# Altium schematic sheet SDEC944-xD_D‚tecteurs_pr‚sence_(alim+signal+ouverture).SchDoc: Détecteurs présence (alim+signal+ouverture capot)
size 393 x 270 mm; CompanyName: Seccom; Address1: 521, rue du capt. François Garbit; Address2: 69440 Mornant; Address3: seccom@seccom.fr; Address4: www.seccom.fr; DocumentNumber: 11; SheetNumber: 11; SheetTotal: 22; PageSetup: Record=PageOptions|CenterHorizontal=True|CenterVertical=True|PrintScale=0.74|XCorrection=1.00|YCorrection=1.00|PrintKind=0|BorderSize=5000000|LeftOffset=0|BottomOffset=0|Orientation=2|PaperLength=1000|PaperWidth=1000|Scale=100|PaperSource=7|PrintQuality=-4|MediaType=1|DitherType=10|PaperKind=A4|PrintScaleMode=1
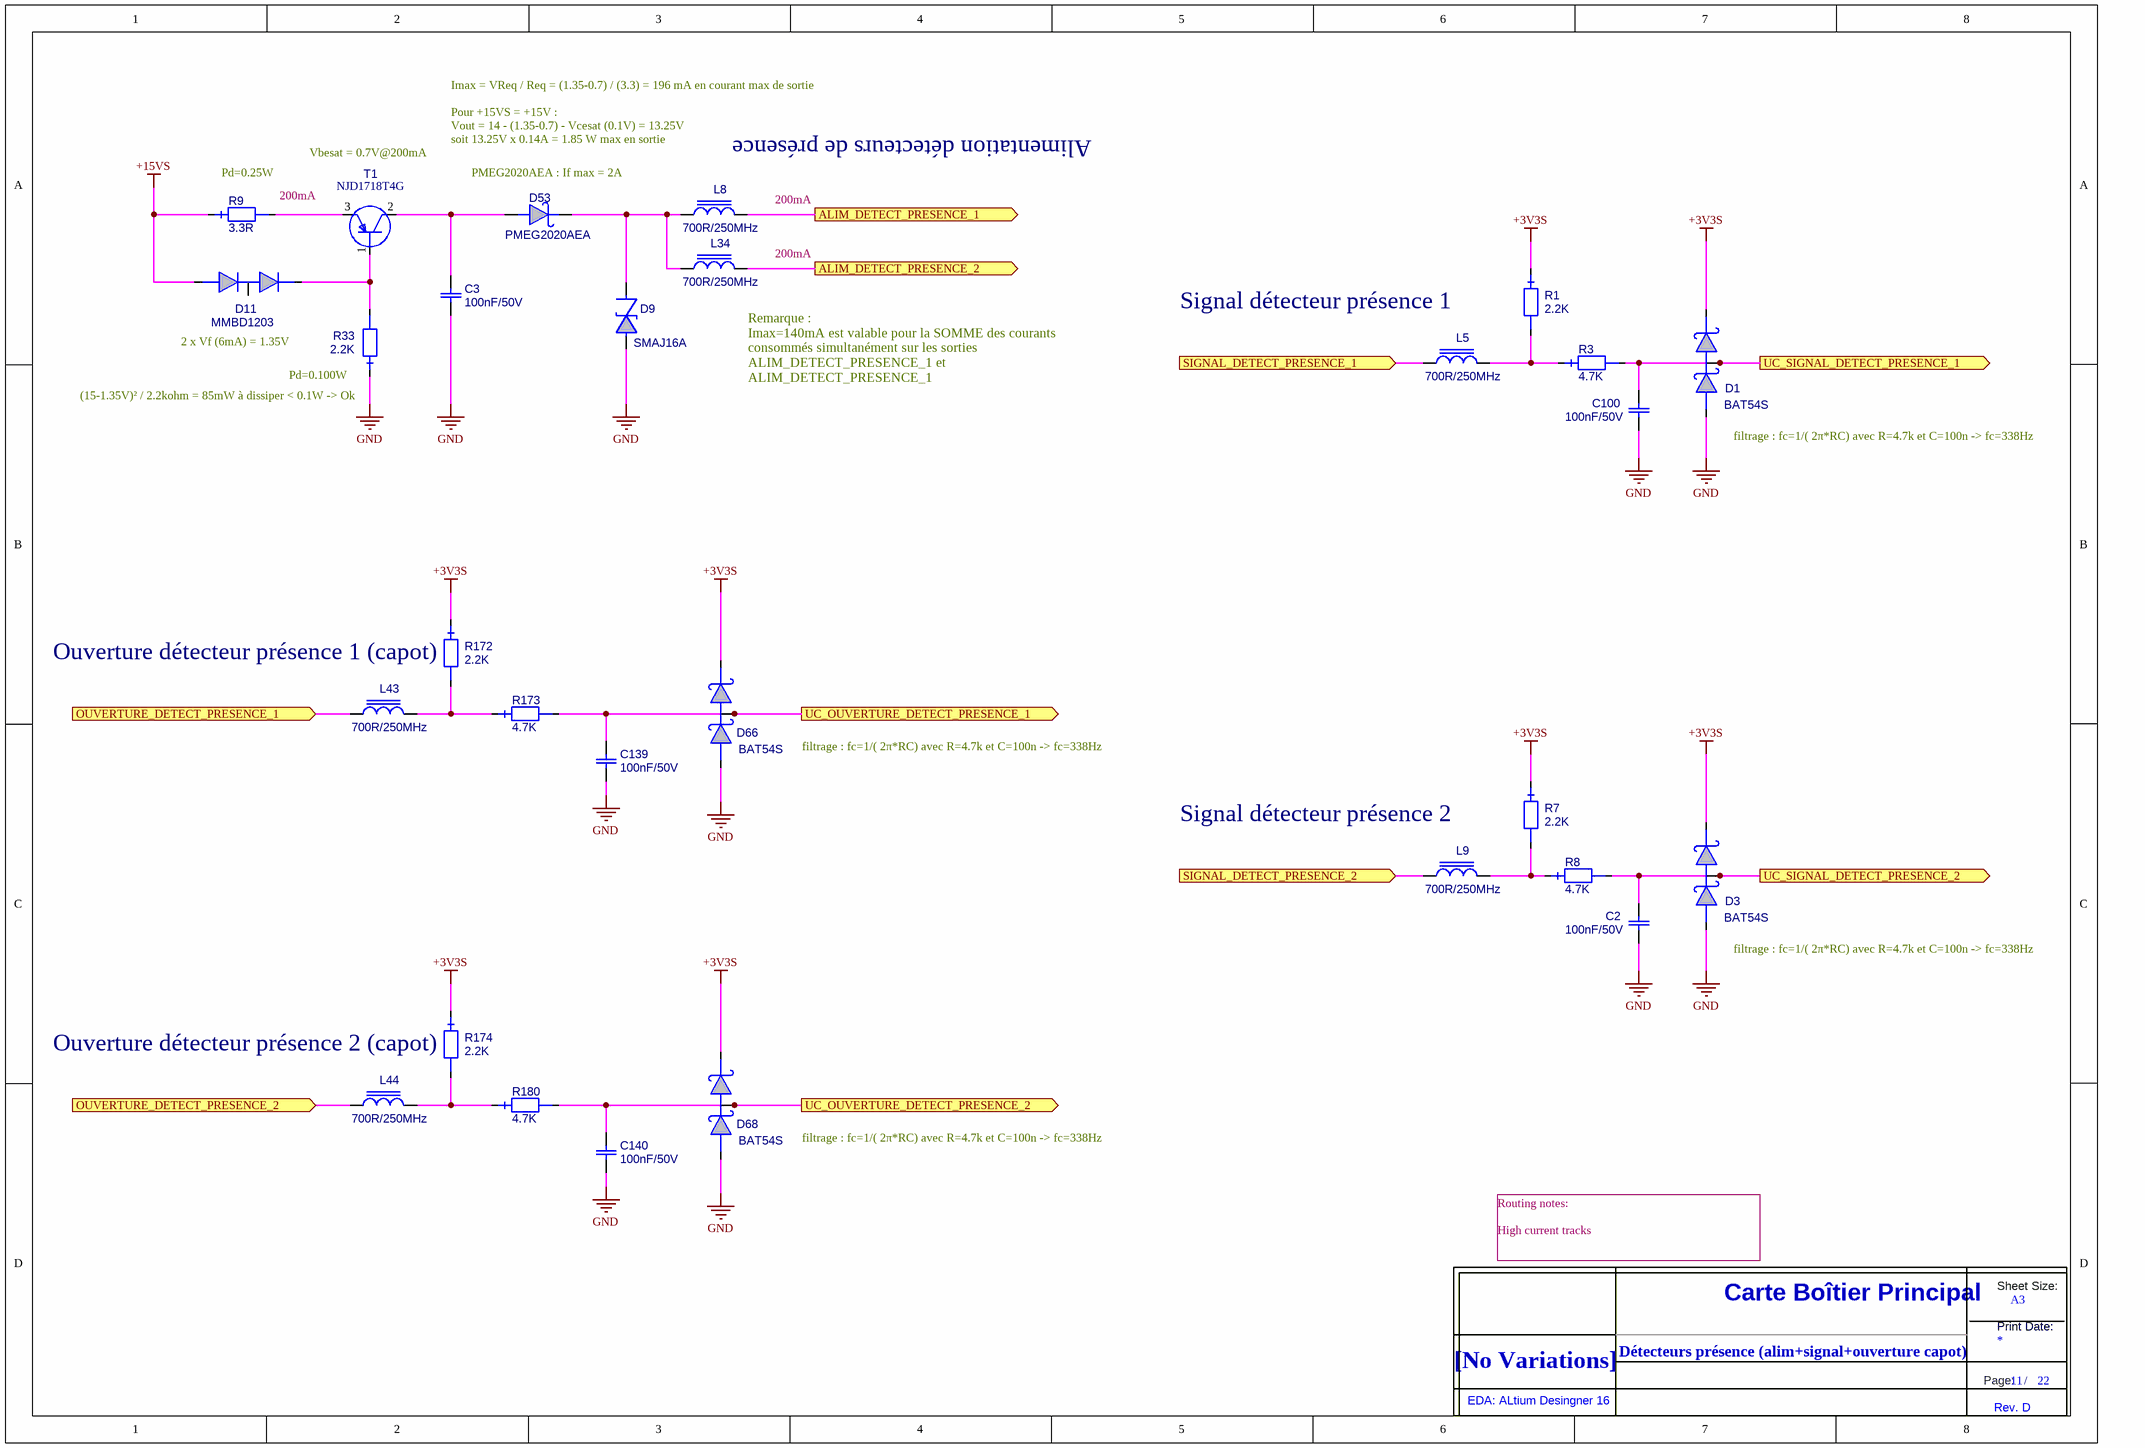
[diagram p0: SDEC944-xD_D‚tecteurs_pr‚sence_(alim+signal+ouverture).SchDoc]

## Parts
C2  value 100nF/50V  [0603_ReflowSoldering_CAP]  (hidden comment: C_0603_X7R_10%_100N-50V)
C3  value 100nF/50V  [0603_ReflowSoldering_CAP]  (hidden comment: C_0603_X7R_10%_100N-50V)
C100  value 100nF/50V  [0603_ReflowSoldering_CAP]  (hidden comment: C_0603_X7R_10%_100N-50V)
C139  value 100nF/50V  [0603_ReflowSoldering_CAP]  (hidden comment: C_0603_X7R_10%_100N-50V)
C140  value 100nF/50V  [0603_ReflowSoldering_CAP]  (hidden comment: C_0603_X7R_10%_100N-50V)
D1  BAT54S  [SOT23_3L_ReflowSoldering]
D3  BAT54S  [SOT23_3L_ReflowSoldering]
D9  SMAJ16A  [DO214AC-SMA-P_ReflowSoldering]
D11  MMBD1203  [SOT23_3L_ReflowSoldering]
D53  PMEG2020AEA  [SOD323_ReflowSoldering]
D66  BAT54S  [SOT23_3L_ReflowSoldering]
D68  BAT54S  [SOT23_3L_ReflowSoldering]
L5  value 700R/250MHz  [0603_ReflowSoldering_CAP]  (hidden comment: IND_FERRITE_0603_742792643)
L8  value 700R/250MHz  [0603_ReflowSoldering_CAP]  (hidden comment: IND_FERRITE_0603_742792643)
L9  value 700R/250MHz  [0603_ReflowSoldering_CAP]  (hidden comment: IND_FERRITE_0603_742792643)
L34  value 700R/250MHz  [0603_ReflowSoldering_CAP]  (hidden comment: IND_FERRITE_0603_742792643)
L43  value 700R/250MHz  [0603_ReflowSoldering_CAP]  (hidden comment: IND_FERRITE_0603_742792643)
L44  value 700R/250MHz  [0603_ReflowSoldering_CAP]  (hidden comment: IND_FERRITE_0603_742792643)
R1  value 2.2K  [0603_ReflowSoldering_RES]  (hidden comment: RES_0603_1%_100PPM_2.2K)
R3  value 4.7K  [0603_ReflowSoldering_RES]  (hidden comment: RES_0603_1%_100PPM_4.7K)
R7  value 2.2K  [0603_ReflowSoldering_RES]  (hidden comment: RES_0603_1%_100PPM_2.2K)
R8  value 4.7K  [0603_ReflowSoldering_RES]  (hidden comment: RES_0603_1%_100PPM_4.7K)
R9  value 3.3R  [1206_ReflowSoldering_RES]  (hidden comment: RES_1206_1%_200PPM_3.3R)
R33  value 2.2K  [0603_ReflowSoldering_RES]  (hidden comment: RES_0603_1%_100PPM_2.2K)
R172  value 2.2K  [0603_ReflowSoldering_RES]  (hidden comment: RES_0603_1%_100PPM_2.2K)
R173  value 4.7K  [0603_ReflowSoldering_RES]  (hidden comment: RES_0603_1%_100PPM_4.7K)
R174  value 2.2K  [0603_ReflowSoldering_RES]  (hidden comment: RES_0603_1%_100PPM_2.2K)
R180  value 4.7K  [0603_ReflowSoldering_RES]  (hidden comment: RES_0603_1%_100PPM_4.7K)
T1  NJD1718T4G  [DPAK_Specifique_1]
Title_new  DNI  (value not drawn)  (graphical)

## Ports
ALIM_DETECT_PRESENCE_1 (out), ALIM_DETECT_PRESENCE_2 (out), OUVERTURE_DETECT_PRESENCE_1 (in), OUVERTURE_DETECT_PRESENCE_2 (in), SIGNAL_DETECT_PRESENCE_1 (in), SIGNAL_DETECT_PRESENCE_2 (in), UC_OUVERTURE_DETECT_PRESENCE_1 (out), UC_OUVERTURE_DETECT_PRESENCE_2 (out), UC_SIGNAL_DETECT_PRESENCE_1 (out), UC_SIGNAL_DETECT_PRESENCE_2 (out)

## Nets
+3V3S: D1.2 D3.2 D66.2 D68.2 R1.1 R7.1 R172.1 R174.1
+15VS: D11.1 R9.1
GND: C2.2 C3.2 C100.2 C139.2 C140.2 D1.1 D3.1 D9.A D66.1 D68.1 R33.1
ALIM_DETECT_PRESENCE_1: L8.2 ; port ALIM_DETECT_PRESENCE_1
ALIM_DETECT_PRESENCE_2: L34.2 ; port ALIM_DETECT_PRESENCE_2
OUVERTURE_DETECT_PRESENCE_1: L43.1 ; port OUVERTURE_DETECT_PRESENCE_1
OUVERTURE_DETECT_PRESENCE_2: L44.1 ; port OUVERTURE_DETECT_PRESENCE_2
SIGNAL_DETECT_PRESENCE_1: L5.1 ; port SIGNAL_DETECT_PRESENCE_1
SIGNAL_DETECT_PRESENCE_2: L9.1 ; port SIGNAL_DETECT_PRESENCE_2
UC_OUVERTURE_DETECT_PRESENCE_1: C139.1 D66.3 R173.2 ; port UC_OUVERTURE_DETECT_PRESENCE_1
UC_OUVERTURE_DETECT_PRESENCE_2: C140.1 D68.3 R180.2 ; port UC_OUVERTURE_DETECT_PRESENCE_2
UC_SIGNAL_DETECT_PRESENCE_1: C100.1 D1.3 R3.2 ; port UC_SIGNAL_DETECT_PRESENCE_1
UC_SIGNAL_DETECT_PRESENCE_2: C2.1 D3.3 R8.2 ; port UC_SIGNAL_DETECT_PRESENCE_2
NetC3_1: C3.1 D53.A T1.2(C)
NetD9_K: D9.K D53.K L8.1 L34.1
NetD11_2: D11.2 R33.2 T1.1(B)
NetL5_2: L5.2 R1.2 R3.1
NetL9_2: L9.2 R7.2 R8.1
NetL43_2: L43.2 R172.2 R173.1
NetL44_2: L44.2 R174.2 R180.1
NetR9_2: R9.2 T1.3(E)

Not connected (* = marked no-connect by the designer): D11 3

## Notes on the sheet
- Imax = VReq / Req = (1.35-0.7) / (3.3) = 196 mA en courant max de sortie
- Pour +15VS = +15V :
- (near R9) Pd=0.25W
- Vbesat = 0.7V@200mA
- soit 13.25V x 0.14A = 1.85 W max en sortie
- Vout = 14 - (1.35-0.7) - Vcesat (0.1V) = 13.25V
- (near D53) PMEG2020AEA : If max = 2A
- Alimentation détecteurs de présence
- (near R9) 200mA
- (near L8) 200mA
- 200mA
- (near R1) Signal détecteur présence 1
- 2 x Vf (6mA) = 1.35V
- (near R33) Pd=0.100W
- (near R33) (15-1.35V)² / 2.2kohm = 85mW à dissiper < 0.1W -> Ok
- (near L34) Remarque :
  Imax=140mA est valable pour la SOMME des courants consommés simultanément sur les sorties ALIM_DETECT_PRESENCE_1 et ALIM_DETECT_PRESENCE_1
- (near D1) filtrage : fc=1/( 2π*RC) avec R=4.7k et C=100n -> fc=338Hz
- (near R172) Ouverture détecteur présence 1 (capot)
- filtrage : fc=1/( 2π*RC) avec R=4.7k et C=100n -> fc=338Hz
- (near R7) Signal détecteur présence 2
- (near D3) filtrage : fc=1/( 2π*RC) avec R=4.7k et C=100n -> fc=338Hz
- (near R174) Ouverture détecteur présence 2 (capot)
- Routing notes:
  High current tracks
- Détecteurs présence (alim+signal+ouverture capot)
- (in symbol Title_new) Sheet Size:; Carte Boîtier Principal; A3; Print Date:; [No Variations]; Page:; /; EDA: ALtium Desingner 16; Rev. D

## Library data of the parts
C2 C3 C100 C139 C140 = C_0603_X7R_10%_100N-50V: Condensateur céramique, X7R, 10%, CMS 0603, 100nF/50V; Creation: FB (29/02/12); Boitier: 0603; Remarque: {Remarque}; Fabricant: Kemet; Ref Fab: C0603C104K5RAC; Coeff: 1; ComponentLink1URL: O:\_Documentation\Datasheets\Kemet\Condos_Ceramic_CMS.pdf; ComponentLink2URL: o:\_Documentation\Datasheets\_BOITIERS\PASSIF_CMS\; Config: *; ComponentLink1Description: Datasheet; ComponentLink2Description: Datasheet Boitier; Supplier 1: Farnell; Supplier Part Number 1: 1288255
D1 D3 D66 D68 = BAT54S: Diode Schottky double, BAT54 en série, Vrrm=30V, If=200mA, Vf=0.4Vmax, CMS; Creation: JMP 05/09/2002; Verification: GO (26/09/02); Reference: 000206/00; Boitier: SOT23_3L; Remarque: {Remarque}; Coeff: 1; Fabricant: NXP; ComponentLink1URL: O:\_Documentation\Datasheets\NXP\BAT54_series.pdf; ComponentLink2URL: o:\_Documentation\Datasheets\_BOITIERS\ACTIF_CMS\SOT\SOT_23_3P_(Schneider).PDF; Config: *; ComponentLink1Description: Datasheet; ComponentLink2Description: Datasheet Boitier; Ref Fab: BAT54S; Supplier 1: Farnell; Supplier Part Number 1: 1081194; Value: BAT54S; Supplier 2: Mouser; Supplier Part Number 2: 771-BAT54S-T/R
D9 = SMAJ16A: Diode Transil/TVS unidirectionnelle (A), Transzorb, 400W, 16V, CMS; Creation: ZA (29/07/13); Boitier: DO214AC/SMA; Remarque: {Remarque}; Coeff: 1; Fabricant: Bourns; ComponentLink1URL: o:\_Documentation\Datasheets\Bourns\SMAJ-74970.pdf; ComponentLink2URL: o:\_Documentation\Datasheets\_BOITIERS\ACTIF_CMS\SMx\SMB_(Schneider).lnk; Config: *; ComponentLink1Description: Datasheet; ComponentLink2Description: Datasheet Boitier; Ref Fab: SMAJ16A; Supplier 1: Farnell; Supplier Part Number 1: 1843352; Supplier 2: Mouser; Supplier Part Number 2: 652-SMAJ16A; Value: SMAJ16A
D11 = MMBD1203: Diode de Redressement double, en série, Vrrm=100V, If=200mA, Vf=1V, rapide (trr=4ns), CMS; Creation: LJ (28/04/11); Reference: 001730/00; Boitier: SOT23_3L; Remarque: {Remarque}; Coeff: 1; Fabricant: Fairchild; ComponentLink1URL: o:\_Documentation\Datasheets\Fairchild\MMBD1201-2-3-4-5.pdf; ComponentLink2URL: o:\_Documentation\Datasheets\_BOITIERS\ACTIF_CMS\SOT\SOT_23_3P_(Schneider).PDF; Config: *; ComponentLink1Description: Datasheet; ComponentLink2Description: Datasheet Boitier; Supplier 1: Farnell; Supplier 2: Mouser; Supplier Part Number 1: 1700901; Supplier Part Number 2: 512-MMBD1203; Ref Fab: MMBD1203; Value: MMBD1203
D53 = PMEG2020AEA: Diode Schottky, Vrrm=20V, If=2A, Vf=0.45V, CMS; Creation: PDP (10/07/12); Boitier: SOD323; Remarque: {Remarque}; Coeff: 1; Fabricant: NXP; Verification: *; ComponentLink1URL: o:\_Documentation\Datasheets\NXP\PMEG2020AEA.PDF; ComponentLink2URL: o:\_Documentation\Datasheets\_BOITIERS\ACTIF_CMS\SOD\SOD_80_(MLL34)_(Schneider).PDF; Config: *; ComponentLink1Description: Datasheet; ComponentLink2Description: Datasheet Boitier; Ref Fab: PMEG2020AEA; Value: PMEG2020AEA
L5 L8 L9 L34 L43 L44 = IND_FERRITE_0603_742792643: Inductance à ferrite multicouches CMS, imp=700R@250MHz, +/-25%, Rdc=350mR, I=400mA; Creation: PDP (02/08/12); Boitier: 0603; Coeff: 1; Fabricant: Wurth Elektronik; ComponentLink1URL: o:\_Documentation\Datasheets\Murata\Ferrite_BLM21P.pdf; Config: *; ComponentLink1Description: Datasheet; ComponentLink2Description: Datasheet Boitier; Ref Fab: 742792643; Supplier 1: Farnell; Supplier Part Number 1: 1800349
R1 R7 R33 R172 R174 = RES_0603_1%_100PPM_2.2K: Résistance, 0.100W, 1%, 100ppm, 75V, 2.2K; Creation: JPL (05/07/12); Boitier: 0603; Remarque: {Remarque}; Fabricant: Vishay; Ref Fab: CRCW06032K20FKEA; Coeff: 1; Verification: *; ComponentLink1URL: O:\_Documentation\Datasheets\Vishay\Resistances_D-CRCWe3.pdf; ComponentLink2URL: o:\_Documentation\Datasheets\_BOITIERS\PASSIF_CMS\; Config: *; ComponentLink1Description: Datasheet; ComponentLink2Description: Datasheet Boitier; Supplier 1: Farnell; Supplier 2: RadioSpares; Supplier Part Number 1: 1469765; Supplier Part Number 2: 6790112
R3 R8 R173 R180 = RES_0603_1%_100PPM_4.7K: Résistance, 0.100W, 1%, 100ppm, 75V, 4.7K; Creation: JPL (05/07/12); Boitier: 0603; Remarque: {Remarque}; Fabricant: Vishay; Ref Fab: CRCW06034K70FKEA; Coeff: 1; Verification: *; ComponentLink1URL: O:\_Documentation\Datasheets\Vishay\Resistances_D-CRCWe3.pdf; ComponentLink2URL: o:\_Documentation\Datasheets\_BOITIERS\PASSIF_CMS\; Config: *; ComponentLink1Description: Datasheet; ComponentLink2Description: Datasheet Boitier; Supplier 1: Farnell; Supplier 2: RadioSpares; Supplier Part Number 1: 1469807; Supplier Part Number 2: 6790484
R9 = RES_1206_1%_200PPM_3.3R: Résistance, 0.25W, 1%, 200ppm, 200V, 3.3R; Creation: LJ (14/01/14); Boitier: 1206; Remarque: {Remarque}; Fabricant: Yageo; Ref Fab: RC1206FR-073R3L; Coeff: 1; Verification: *; ComponentLink1URL: O:\_Documentation\Datasheets\Yageo\resistances_RC1206.pdf; ComponentLink2URL: o:\_Documentation\Datasheets\_BOITIERS\PASSIF_CMS\; Config: *; ComponentLink1Description: Datasheet; ComponentLink2Description: Datasheet Boitier; Supplier 1: Farnell; Supplier 2: Mouser; Supplier Part Number 1: 9236589; Supplier Part Number 2: 603-RC1206FR-073R3L
T1 = NJD1718T4G: Transistor PNP, Vce=50V, Ic=3A, 15W, hfe=40~240, -65/+150°C, CMS; Creation: PDP (19/09/12); Boitier: DPAK; Remarque: {Remarque}; Coeff: 1; Fabricant: ON Semiconductor; ComponentLink1URL: o:\_Documentation\Datasheets\ON_Semiconductors\NJD1718-D.PDF; Config: *; ComponentLink1Description: Datasheet; ComponentLink2Description: Datasheet Boitier; Supplier 1: Mouser; Supplier Part Number 1: 863-NJD1718T4G; Ref Fab: NJD1718T4G; Value: NJD1718T4G
Title_new = Title_new